# Altium schematic sheet I2C Conventor.SchDoc: =ProjectTitle
size 297 x 209 mm; Address1: Address1; Address2: Address2; Address3: Address3; Address4: Address4; SheetNumber: 3; SheetTotal: 4; Scale: 1:1; DocumentType: Схема электрическая принципиальная
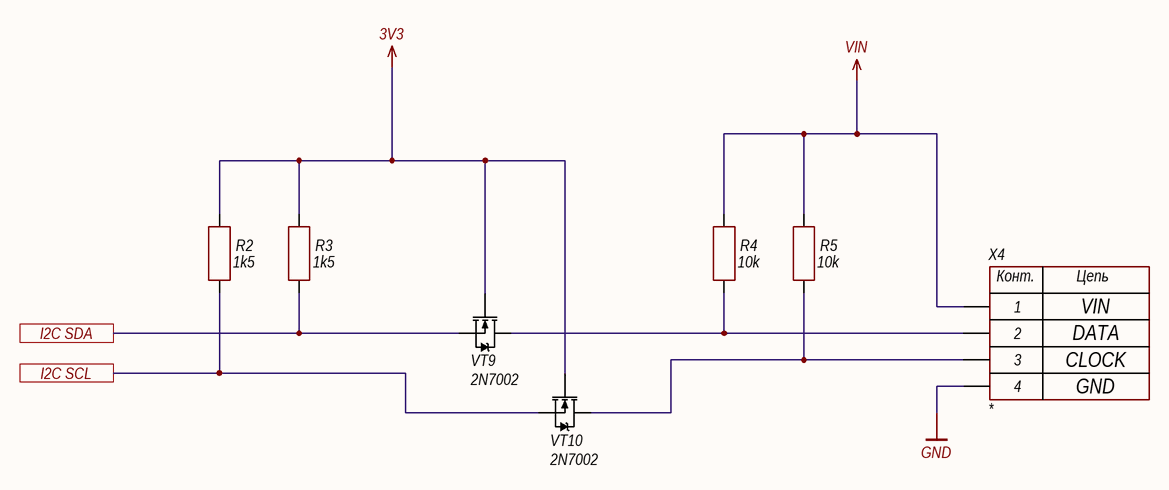
[diagram p0: I2C Conventor.SchDoc]

## Parts
R2  1k5  [CH0603R]
R3  1k5  [CH0603R]
R4  10k  [CH0603R]
R5  10k  [CH0603R]
VT9  2N7002  [SOT23_123]
VT10  2N7002  [SOT23_123]
X4  *  [CON: PLS-4]

## Ports
I2C SCL, I2C SDA

## Nets
3V3: R2.2 R3.2 VT9.1(G) VT10.1(G)
GND: X4.4
VIN: R4.2 R5.2 X4.1
I2C SCL: R2.1 VT10.3(S) ; port I2C SCL
I2C SDA: R3.1 VT9.3(S) ; port I2C SDA
NetR4_1: R4.1 VT9.2(D) X4.2
NetR5_1: R5.1 VT10.2(D) X4.3

## Notes on the sheet
- VIN
- DATA
- CLOCK
- GND
- Инв. № подл.
- Подп. и дата
- Взам. инв. №
- Инв. № дубл.
- Изм.
- Лист
- № докум.
- Подп.
- Дата
- Копировал
- Формат А4
- (in symbol 4-Connector) Конт.; Цепь

## Library data of the parts
R2-R5 = Resistor: Manufacturer: *; Model: *; HelpURL: *; ComponentKind: *
  R2 R3: Value: 1k5
  R4 R5: Value: 10k
VT9 VT10 = N-chanel: Mosfet; Manufacturer: ON Semiconductor; Model: 2N7002; ComponentKind: 0.2А, 60В; HelpURL: https://static.chipdip.ru/lib/318/DOC000318735.pdf
X4 = 4-Connector: Model: *; Manufacturer: *; HelpURL: *; ComponentKind: *